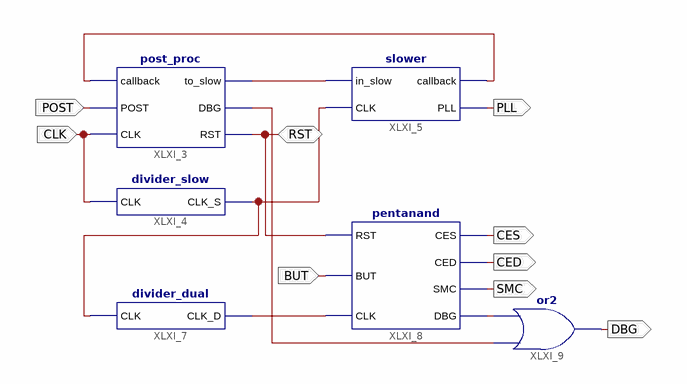
[diagram p0: schematic sheet 1]
// Xilinx ISE schematic overall.sch (xbr) as structural Verilog: 6 symbols, 12 ports
module overall (
  input  POST,
  input  CLK,
  input  BUT,
  inout  RST,
  output DBG,
  output PLL,
  output CES,
  output CED,
  output CEQ,
  output CET,
  output CEP,
  output SMC
);

  wire XLXN_6, XLXN_7, XLXN_11, XLXN_16, XLXN_37, XLXN_41;

  post_proc XLXI_3 (.CLK(CLK), .to_slow(XLXN_6), .DBG(XLXN_41), .RST(RST), .POST(POST), .callback(XLXN_11));
  divider_slow XLXI_4 (.CLK(CLK), .CLK_S(XLXN_7));
  slower XLXI_5 (.CLK(XLXN_7), .in_slow(XLXN_6), .PLL(PLL), .callback(XLXN_11));
  divider_dual XLXI_7 (.CLK(XLXN_7), .CLK_D(XLXN_16));
  pentanand XLXI_8 (
    .RST(RST), .BUT(BUT), .CLK(XLXN_16), .CES(CES), .CED(CED), .CET(CET), .CEQ(CEQ), .CEP(CEP), .SMC(SMC),
    .DBG(XLXN_37));
  or XLXI_9 (DBG, XLXN_41, XLXN_37);
endmodule
